# Altium schematic sheet Buck Converter Schematic.SchDoc
size A4; SheetNumber: 1; SheetTotal: 1
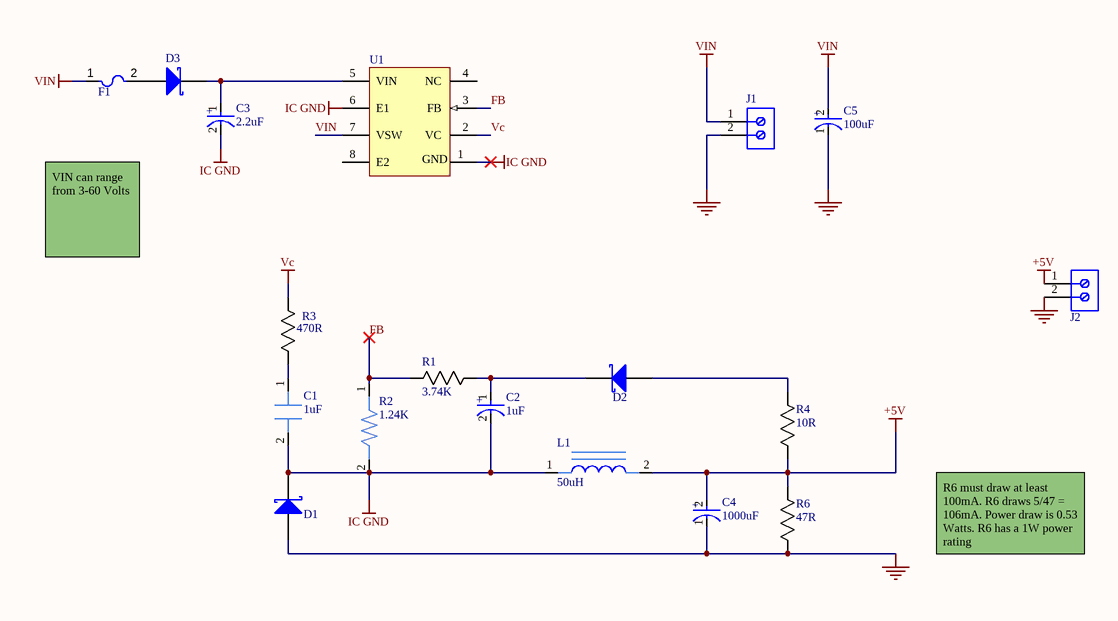
[diagram p0: Buck Converter Schematic.SchDoc]

## Parts
C1  value 1uF  [C1210C105K5RACTU]  (hidden comment: CL10B105KA8NNNC)
C2  value 1uF  [Radial, Can]  (hidden comment: 860020672005)
C3  value 2.2uF  [Radial, Can]  (hidden comment: 860020672006)
C4  value 1000uF  [25PX1000MEFCT810X16]  (hidden comment: 16ZLH1000MEFC10X16)
C5  value 100uF  [35ZLH100MEFC6.3X11]  (hidden comment: 35ZLH100MEFC6.3X11)
D1  BAT46W-7-F  [DIOD-SOD-123-2_V]  (value not drawn)
D2  BAT46W-7-F  [DIOD-SOD-123-2_V]  (value not drawn)
D3  BAT46W-7-F  [DIOD-SOD-123-2_V]  (value not drawn)
F1  0ZCF0185FF2C  [2920 (7351 Metric), Concave]  (value not drawn)
J1  691137710002  [691137710002]  (value not drawn)
J2  691137710002  [691137710002]  (value not drawn)
L1  value 50uH  [CTX50-1-52-R]  (hidden comment: CTX50-1-52-R)
R1  Resistance: 3.74K  [0805]  (hidden comment: RMCF0805FT3K74)
R2  value 1.24K  [RC0805FR-071K24L]  (hidden comment: RC0805FR-071K24L)
R3  Resistance: 470R  [0805]  (hidden comment: RMCF0805FT470R)
R4  Resistance: 10R  [0805]  (hidden comment: RMCF0805JT10R0)
R6  Resistance: 47R  [0805]  (hidden comment: LTR10EZPJ470)
U1  LT1172CN8#PBF  [LT1172CN8#PBF-ND]  (value not drawn)

## Nets
+5V: C4.2(A) J2.1 L1.2 R4.1 R6.2
GND: C4.1(C) C5.1(C) D1.1(A) J1.2 J2.2 R6.1
IC GND: C1.2 C2.2(C) C3.2(C) D1.2(K) L1.1 R2.2 U1.6(E1)
Vc: R3.2 U1.2(VC)
VIN: C5.2(A) F1.1 J1.1 U1.7(VSW)
FB: R1.1 R2.1 U1.3(FB)
NetC1_1: C1.1 R3.1
NetC2_1: C2.1(A) D2.2(K) R1.2
NetC3_1: C3.1(A) D3.2(K) U1.5(VIN)
NetD2_1: D2.1(A) R4.2
NetD3_1: D3.1(A) F1.2

Not connected (* = marked no-connect by the designer): U1 1(GND) 4(NC) 8(E2)

## Notes on the sheet
- VIN can range from 3-60 Volts
- R6 must draw at least 100mA. R6 draws 5/47 = 106mA. Power draw is 0.53 Watts. R6 has a 1W power rating
- (in symbol 16ZLH1000MEFC10X16) +
- (in symbol 860020672005) +
- (in symbol 860020672006) +
- (in symbol a00bbbee19879c290e62620ae7e47b1) +

## Library data of the parts
C1 = CL10B105KA8NNNC: Ceramic Capacitor 1uF; Manufacturer: KEMET; Manufacturer Part Number: ESL105M100AC3AA; Capacitor Type: Aluminium; Supplier: Digikey; Supplier Part Number: 399-15737-ND; RoHS: Yes; Stock: 14632; Pricing: 1=0.15, 10=0.095, 50=0.0708, 100=0.0633, 500=0.04972, 1000=0.04522, 2500=0.04024, 5000=0.03706 (USD); Pins: 2; Reach SVHC Compliant: Yes; RoHS Compliant: Yes; ComponentLink1URL: https://datasheet.ciiva.com:443/pdfs/VipMasterIC/IC/KEME/KEME-S-A0008958449/KEME-S-A0008958449-1.pdf?src-supplier=IHS+Markit; ComponentLink1Description: https://datasheet.ciiva.com:443/pdfs/VipMasterIC/IC/KEME/KEME-S-A0008958449/KEME-S-A0008958449-1.pdf?src-supplier=IHS+Markit; ComponentLink2URL: https://api.kemet.com/component-edge/download/datasheet/ESL105M100AC3AA.pdf?src-supplier=Digikey; ComponentLink2Description: https://api.kemet.com/component-edge/download/datasheet/ESL105M100AC3AA.pdf?src-supplier=Digikey; ComponentLink3URL: https://datasheet.octopart.com/ESL105M100AC3AA-KEMET-datasheet-176335207.pdf?src-supplier=Newark; ComponentLink3Description: https://datasheet.octopart.com/ESL105M100AC3AA-KEMET-datasheet-176335207.pdf?src-supplier=Newark; Supplier 1: Avnet; Supplier Part Number 1: CL10B105KA8NNNC
C2 = 860020672005: 1 µF 50 V Aluminum Electrolytic Capacitors Radial, Can 2000 Hrs @ 105°C; Supplier 1: Digikey; Supplier Part Number 1: 732-8851-1-ND
C3 = 860020672006: 2.2 µF 50 V Aluminum Electrolytic Capacitors Radial, Can 2000 Hrs @ 105°C; Supplier 1: Digikey; Supplier Part Number 1: 732-8852-1-ND
C4 = 16ZLH1000MEFC10X16: Aluminum Electrolytic Capacitor, Polarized, Aluminum (wet), 16V, 20% +Tol, 20% -Tol, 1000uF, Through Hole Mount; Manufacturer: Rubycon; Manufacturer Series: ZLH; Dielectric Material: Aluminium; Leakage Current: 160uA; Ripple Current: 1.056A; Tan Delta: 0.16; Supplier: Digikey; Supplier Part Number: 1189-1147-ND; Manufacturer Part Number: 16ZLH1000MEFC10X16; RoHS: Yes; Category: Aluminum Electrolytic Capacitors; Stock: 32532; Pricing: 1=0.61, 10=0.377, 50=0.2812, 100=0.2505, 500=0.19778, 1000=0.18113, 3000=0.16029, 5000=0.1525 (USD); Mounting Technology: Through Hole; Pins: 2; Package Shape: Cylindrical; Min Operating Temperature: -40°C; Max Operating Temperature: 105°C; Polarity: Polarized; Capacitor Type: Aluminium; Tolerance  (fill in as +-): 20%; Package Style: RadialMeter; Packaging: Bulk; Tolerance (fill in as +-): 20%; Rated DC Voltage (URdc): 16V; Termination: Wire; Diameter: 10mm; Length: 16mm; Terminal Pitch: 5mm; Reach SVHC Compliant: Yes; RoHS Compliant: Yes; ComponentLink1URL: https://datasheet.ciiva.com:443/pdfs/VipMasterIC/IC/RUBY/RUBYS01453/RUBYS01453-1.pdf?src-supplier=IHS+Markit; ComponentLink1Description: https://datasheet.ciiva.com:443/pdfs/VipMasterIC/IC/RUBY/RUBYS01453/RUBYS01453-1.pdf?src-supplier=IHS+Markit; ComponentLink2URL: https://datasheet.ciiva.com/6300/e-zlh-6300460.pdf?src-supplier=Digikey; ComponentLink2Description: https://datasheet.ciiva.com/6300/e-zlh-6300460.pdf?src-supplier=Digikey; ComponentLink3URL: https://datasheet.ciiva.com/11692/e-zlh-11692166.pdf?src-supplier=Avnet; ComponentLink3Description: https://datasheet.ciiva.com/11692/e-zlh-11692166.pdf?src-supplier=Avnet; ComponentLink4URL: https://datasheet.ciiva.com/16313/e-zlh-16313390.pdf?src-supplier=Future+Electronics; ComponentLink4Description: https://datasheet.ciiva.com/16313/e-zlh-16313390.pdf?src-supplier=Future+Electronics; ComponentLink5URL: https://datasheet.ciiva.com/22732/1910927-22732477.pdf?src-supplier=Element14; ComponentLink5Description: https://datasheet.ciiva.com/22732/1910927-22732477.pdf?src-supplier=Element14
C5 = a00bbbee19879c290e62620ae7e47b1: CAP ALUM 100UF 20% 35V RADIAL; Lead Diameter: 0.5mm; Leakage Current: 3uA; Ripple Current (AC): 540mA; Life (Hours): 6000Hour; Dielectric Material: Aluminium; Impedance: 94mR; Number of Pins: 2; Voltage: 35V; Case/Package: Radial; Min Operating Temperature: -40°C; Height - Seated (Max): 0.492inch; Height: 11mm; Tolerance: 20%; REACH SVHC: No SVHC; Series: ZLH; Radiation Hardening: No; Ripple Current: 540mA; Package Quantity: 2000; Max Operating Temperature: 105°C; Lead Pitch: 2.5mm; Termination: Radial; Voltage Rating: 35V; Diameter: 6.3mm; Packaging: Bulk; Construction: RADIAL; Voltage Rating (DC): 35V; Mount: Through Hole; RoHS Compliant: Yes; Capacitance: 100uF
D1-D3 = CMP-0303-00004-1: Surface Mount Schottky Barrier Diode, 100 V, -55 to 125 degC, 2-Pin SOD123, RoHS, Tape and Reel; Manufacturer: Diodes Inc; IR@1.5 V: 0.3 uA Max.; V(BR)R: 100 V Min.; VF@10 mA: 0.45 V Max.; CT@1 V: 12 pF Typ.; PartNumber: BAT46W-7-F; ComponentLink1URL: http://www.diodes.com/; ComponentLink3URL: http://diodes.com/datasheets/ds30044.pdf; PackageDescription: 2-Pin SMD, Body 2.7 x 1.55 mm, Height 1.45 mm; ComponentLink2Description: Datasheet; ComponentLink3Description: Package Specification; Mounting Technology: Surface Mount; ComponentLink1Description: Manufacturer URL; RoHS: TRUE; Operating Temperature: -55 to 125 degC; Packing: Tape and Reel; ComponentLink2URL: http://diodes.com/datasheets/ds30044.pdf; DatasheetVersion: Rev. 16-2
F1 = 0ZCF0185FF2C: Polymeric PTC Resettable Fuse 33V 1.85 A Ih Surface Mount 2920 (7351 Metric), Concave; Supplier 1: Digikey; Supplier Part Number 1: 5923-0ZCF0185FF2CCT-ND
J1 J2 = CMP-1502-03324-2: NexarPartId: 78871135; Voltage Rating: 300V; Number of Contacts: 2; Current Rating: 16A; Lead Pitch: 5mm; Height: 11.6mm; Packaging: Box; RoHS: Non-Compliant; Contact Material: Nickel, Tin; Max Operating Temperature: 120°C; Number of Pins: 2; Min Operating Temperature: -30°C; Number of Rows: 1
L1 = CTX50-1-52-R: General Purpose Inductor, 50uH, 1 Element, Iron-Core; Manufacturer: Eaton Cooper; Core Material: Ferrite; DC Resistance (DCR): 71.5mR; Inductor Application: POWER INDUCTOR; Channels: 1; Max Current Rating: 2.6A; Shape/Size Description: CYLINDRICAL PACKAGE; Shielding: Unshielded; Surface Mount: No; Lead Diameter: 0.58mm; Lead Length: 10mm; Package Diameter: 16.2mm; Package Length: 9mm; Supplier: Digikey; Supplier Part Number: 513-1108-ND; Manufacturer Part Number: CTX50-1-52-R; RoHS: Yes; Category: Fixed Inductors; Stock: 1049; Pricing: 1=2.67, 10=2.196, 25=2.0312, 50=1.915, 100=1.8057, 300=1.6451, 600=1.55137, 1200=1.46311, 2700=1.36639 (USD); Pins: 2; Min Operating Temperature: -40°C; Max Operating Temperature: 75°C; Construction: Vertical Mount; Inductance-Nom (L): 50uH; Inductor Type: GENERAL PURPOSE INDUCTOR; Package Style: ToroidalMeter; Packaging: Bulk; Terminal Placement: Radial; Termination: Wire; Lead Pitch: 7.5mm; Reach SVHC Compliant: Yes; RoHS Compliant: Yes; ComponentLink1URL: https://datasheet.ciiva.com:443/pdfs/VipMasterIC/IC/ETON/ETON-S-A0008259577/ETON-S-A0008259577-1.pdf?src-supplier=IHS+Markit; ComponentLink1Description: https://datasheet.ciiva.com:443/pdfs/VipMasterIC/IC/ETON/ETON-S-A0008259577/ETON-S-A0008259577-1.pdf?src-supplier=IHS+Markit; ComponentLink2URL: https://datasheet.ciiva.com/8005/705007-8005134.pdf?src-supplier=Element14; ComponentLink2Description: https://datasheet.ciiva.com/8005/705007-8005134.pdf?src-supplier=Element14; ComponentLink3URL: https://datasheet.ciiva.com/16430/bus-elx-ds-pm4304-lpci-series-16430805.pdf?src-supplier=Future+Electronics; ComponentLink3Description: https://datasheet.ciiva.com/16430/bus-elx-ds-pm4304-lpci-series-16430805.pdf?src-supplier=Future+Electronics; ComponentLink4URL: https://datasheet.ciiva.com/30168/4935b080188143dbb73de2176f2c5e73-30168168.pdf?src-supplier=Onlinecomponents.com; ComponentLink4Description: https://datasheet.ciiva.com/30168/4935b080188143dbb73de2176f2c5e73-30168168.pdf?src-supplier=Onlinecomponents.com
R1 = RMCF0805FT3K74: 3.74 kOhms ±1% 0.125W, 1/8W Chip Resistor 0805 (2012 Metric) Automotive AEC-Q200 Thick Film; Supplier 1: Digikey; Supplier Part Number 1: RMCF0805FT3K74CT-ND
R2 = RC0805FR-071K24L: Fixed Resistor, Metal Film, 0.25W, 1240ohm, 250V, 1% +/-Tol, -100,100ppm/Cel; Manufacturer: Yageo; Manufacturer Part Number: MFR-25FBF52-1K24; Supplier: Digikey; Supplier Part Number: 1.24KXBK-ND; RoHS: Yes; Category: Through-Hole Resistors; Stock: 9531; Pricing: 1=0.1, 10=0.039, 25=0.0328, 50=0.0286, 100=0.0251, 250=0.02128, 500=0.0189, 1000=0.01685, 5000=0.01321 (USD); ComponentLink1URL: https://datasheet.ciiva.com:443/pdfs/VipMasterIC/IC/YAGO/YAGO-S-A0009358480/YAGO-S-A0009358480-1.pdf?src-supplier=IHS+Markit; ComponentLink1Description: https://datasheet.ciiva.com:443/pdfs/VipMasterIC/IC/YAGO/YAGO-S-A0009358480/YAGO-S-A0009358480-1.pdf?src-supplier=IHS+Markit; ComponentLink2URL: https://datasheet.ciiva.com/25646/yageolr-mfr-2013-25646123.pdf?src-supplier=Digikey; ComponentLink2Description: https://datasheet.ciiva.com/25646/yageolr-mfr-2013-25646123.pdf?src-supplier=Digikey; Supplier 1: Digikey; Supplier Part Number 1: 311-1.24KCRCT-ND
R3 = RMCF0805FT470R: 470 Ohms ±1% 0.125W, 1/8W Chip Resistor 0805 (2012 Metric) Automotive AEC-Q200 Thick Film; Supplier 1: Digikey; Supplier Part Number 1: RMCF0805FT470RCT-ND
R4 = RMCF0805JT10R0: 10 Ohms ±5% 0.125W, 1/8W Chip Resistor 0805 (2012 Metric) Automotive AEC-Q200 Thick Film; Supplier 1: Digikey; Supplier Part Number 1: RMCF0805JT10R0CT-ND
R6 = LTR10EZPJ470: 47 Ohms ±5% 1W Chip Resistor Wide 0805 (2012 Metric), 0508 Automotive AEC-Q200, Pulse Withstanding Thick Film; Supplier 1: Digikey; Supplier Part Number 1: RHM47BUCT-ND
U1 = LT-LT1172-X8-8: 100 kHz, 1.25 A, High Efficiency Switching Regulator, 8-pin DIP (N8-8), 0 to 100 degC, Pb-Free; Manufacturer: Linear Technology; Number of Outputs: 1; Frequency Sync Range: 120kHz - 160kHz; Mounting Technology: Through Hole; PackageDescription: 8-Pin PDIP, Body 10.16 x 6.48 mm, Pitch 2.54 mm; DatasheetVersion: Rev. G; ComponentLink1Description: Manufacturer URL; RoHS: TRUE; ComponentLink3Description: Package Specification; PackageReference: N8-8; ComponentLink2Description: Datasheet; PackageVersion: Rev. I, 07/2011; PartNumber: LT1172CN8#PBF; ComponentLink3URL: http://www.linear.com/docs/en/packaging/05081510_I_N8.pdf; ComponentLink2URL: http://cds.linear.com/docs/en/datasheet/117012fg.pdf; ComponentLink1URL: http://www.linear.com/